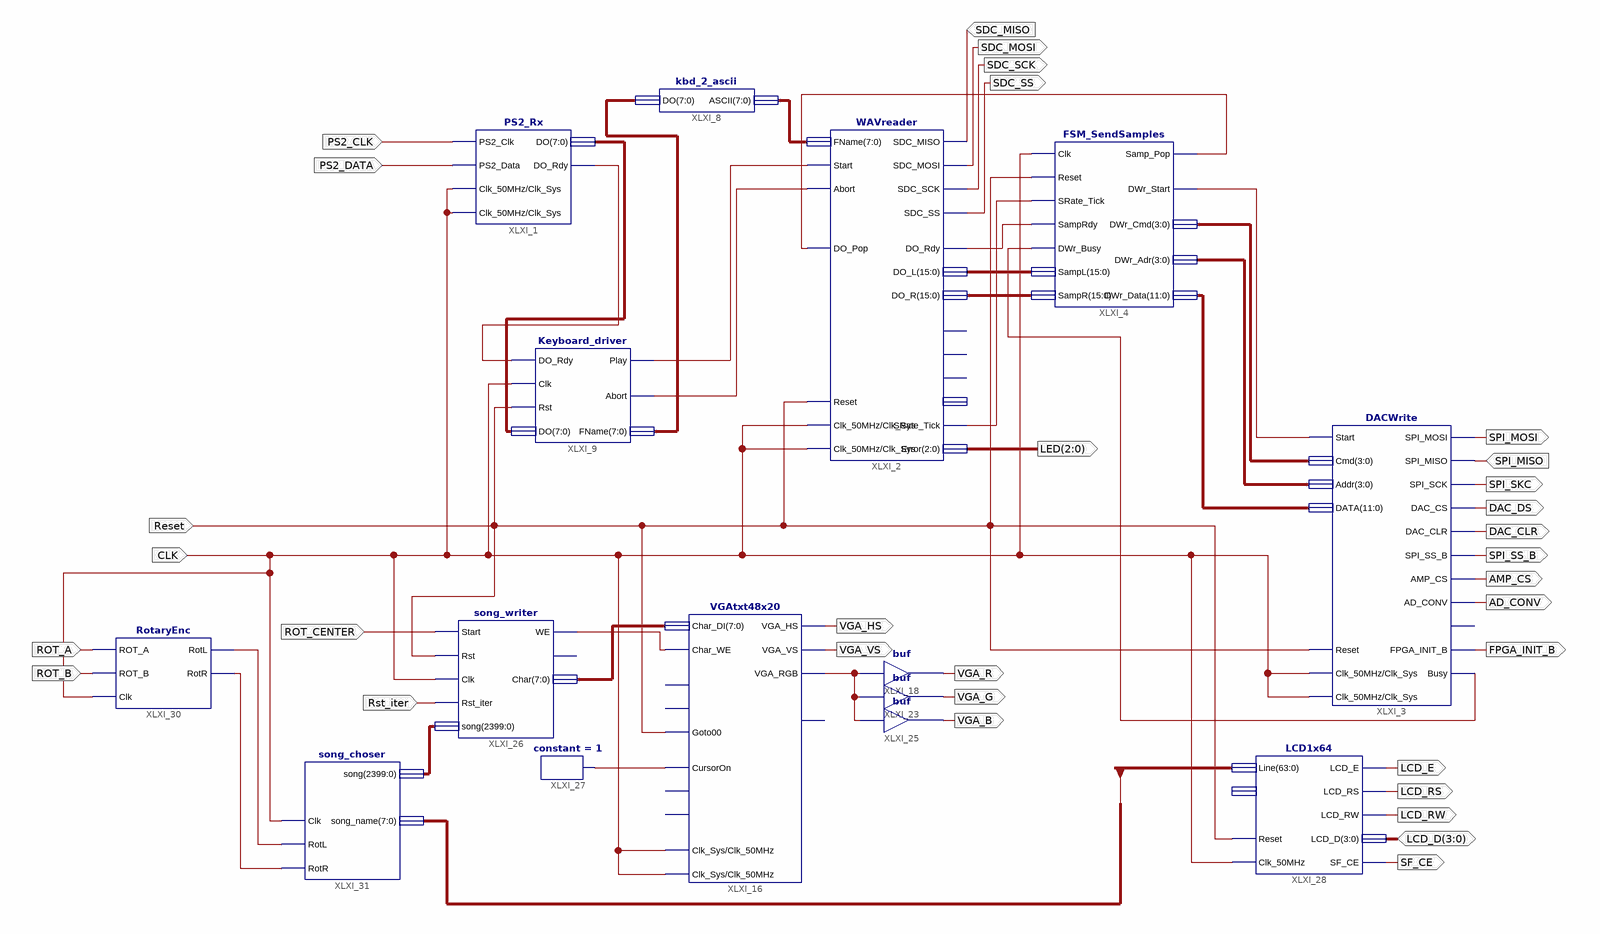
[diagram p0: schematic sheet 1]
// Xilinx ISE schematic main_schema.sch (spartan3e) as structural Verilog: 15 symbols, 32 ports
module main_schema (
  input  PS2_CLK,
  input  PS2_DATA,
  input  SDC_MISO,
  input  Reset,
  input  SPI_MISO,
  input  Rst_iter,
  input  CLK,
  input  ROT_CENTER,
  input  ROT_A,
  input  ROT_B,
  inout  [3:0] LCD_D,
  output [2:0] LED,
  output SDC_SCK,
  output SDC_SS,
  output SDC_MOSI,
  output SPI_MOSI,
  output SPI_SKC,
  output DAC_DS,
  output DAC_CLR,
  output SPI_SS_B,
  output AMP_CS,
  output AD_CONV,
  output FPGA_INIT_B,
  output VGA_HS,
  output VGA_VS,
  output VGA_R,
  output VGA_G,
  output VGA_B,
  output LCD_E,
  output LCD_RS,
  output LCD_RW,
  output SF_CE
);

  wire led6, led7, XLXN_14, XLXN_15, XLXN_19, XLXN_82, XLXN_105, XLXN_213, XLXN_219, XLXN_220, XLXN_226,
       XLXN_318, XLXN_319;
  wire [3:0] XLXN_16, XLXN_17;
  wire [7:0] XLXN_104, XLXN_107, XLXN_108, XLXN_221;
  wire [11:0] XLXN_18;
  wire [15:0] XLXN_8, XLXN_9;
  wire [63:0] Line;
  wire [2399:0] XLXN_324;

  WAVreader XLXI_2 (
    .FName(XLXN_108), .Start(led7), .Abort(led6), .SDC_MOSI(SDC_MOSI), .SDC_SCK(SDC_SCK), .SDC_SS(SDC_SS),
    .SDC_MISO(SDC_MISO), .DO_Pop(XLXN_82), .SRate_Tick(XLXN_15), .Error(LED), .Reset(Reset), .Clk_50MHz(CLK),
    .Clk_Sys(CLK), .DO_Rdy(XLXN_14), .DO_L(XLXN_8), .DO_R(XLXN_9));  // open: FmtMnS, Fmt8n16, FmtSRate, Busy
  FSM_SendSamples XLXI_4 (
    .Clk(CLK), .Reset(Reset), .SRate_Tick(XLXN_15), .SampRdy(XLXN_14), .DWr_Busy(XLXN_213), .SampL(XLXN_8),
    .SampR(XLXN_9), .Samp_Pop(XLXN_82), .DWr_Start(XLXN_19), .DWr_Cmd(XLXN_16), .DWr_Adr(XLXN_17),
    .DWr_Data(XLXN_18));
  PS2_Rx XLXI_1 (
    .PS2_Clk(PS2_CLK), .PS2_Data(PS2_DATA), .Clk_50MHz(CLK), .Clk_Sys(CLK), .DO_Rdy(XLXN_105), .DO(XLXN_104));
  Keyboard_driver XLXI_9 (
    .DO_Rdy(XLXN_105), .Clk(CLK), .Rst(Reset), .DO(XLXN_104), .Play(led7), .Abort(led6), .FName(XLXN_107));
  kbd_2_ascii XLXI_8 (.DO(XLXN_107), .ASCII(XLXN_108));
  DACWrite XLXI_3 (
    .Reset(Reset), .Start(XLXN_19), .SPI_MISO(SPI_MISO), .Cmd(XLXN_16), .Addr(XLXN_17), .DATA(XLXN_18),
    .DAC_CLR(DAC_CLR), .DAC_CS(DAC_DS), .SPI_MOSI(SPI_MOSI), .SPI_SCK(SPI_SKC), .SPI_SS_B(SPI_SS_B),
    .AMP_CS(AMP_CS), .AD_CONV(AD_CONV), .FPGA_INIT_B(FPGA_INIT_B), .Busy(XLXN_213), .Clk_50MHz(CLK),
    .Clk_Sys(CLK));  // open: SF_CE0
  VGAtxt48x20 XLXI_16 (
    .Char_DI(XLXN_221), .Goto00(Reset), .Clk_Sys(CLK), .Clk_50MHz(CLK), .CursorOn(XLXN_226), .VGA_HS(VGA_HS),
    .VGA_VS(VGA_VS), .VGA_RGB(XLXN_219), .Char_WE(XLXN_220));  // open: Home, NewLine, ScrollEn, ScrollClear, Busy
  buf XLXI_18 (VGA_R, XLXN_219);
  buf XLXI_23 (VGA_G, XLXN_219);
  buf XLXI_25 (VGA_B, XLXN_219);
  constant #(.CValue("1")) XLXI_27 (.O(XLXN_226));
  LCD1x64 XLXI_28 (
    .Clk_50MHz(CLK), .Reset(Reset), .Line(Line), .LCD_D(LCD_D), .LCD_E(LCD_E), .LCD_RW(LCD_RW),
    .LCD_RS(LCD_RS), .SF_CE(SF_CE));  // open: Blank
  RotaryEnc XLXI_30 (.ROT_A(ROT_A), .ROT_B(ROT_B), .RotL(XLXN_318), .RotR(XLXN_319), .Clk(CLK));
  song_writer XLXI_26 (
    .Start(ROT_CENTER), .Rst(Reset), .Rst_iter(Rst_iter), .Clk(CLK), .song(XLXN_324), .WE(XLXN_220),
    .Char(XLXN_221));  // open: Busy
  song_choser XLXI_31 (.Clk(CLK), .song(XLXN_324), .song_name(Line[7:0]), .RotL(XLXN_318), .RotR(XLXN_319));
endmodule
